# EAGLE design Executive_230V_A (EAGLE 9.5.0)
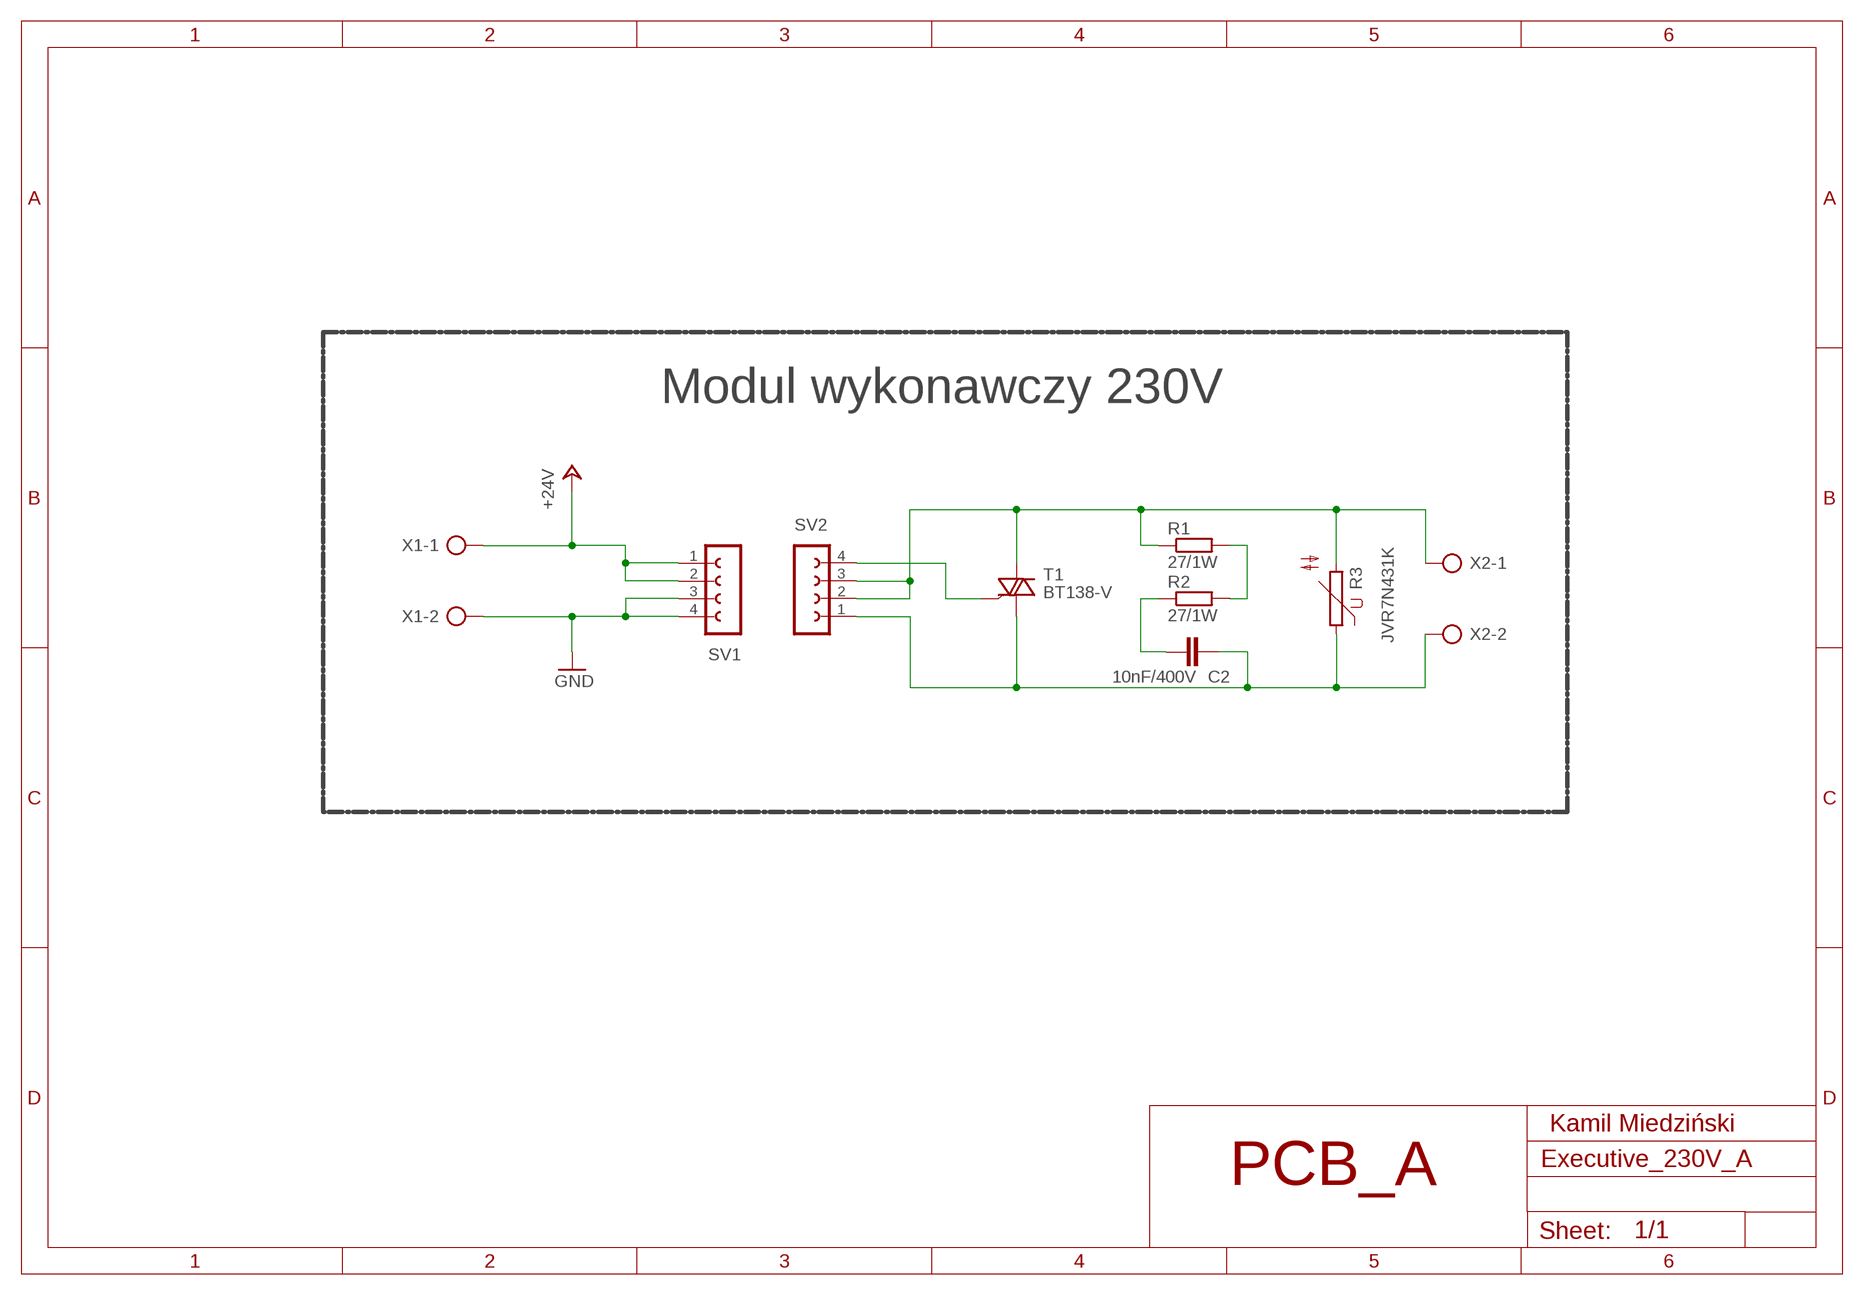
[diagram p0: schematic, sheet 1]

## Parts
C2  10nF/400V  C-EU102-054X133  [C102-054X133]
R1  27/1W  R-EU_0411/15  [0411/15]
R2  27/1W  R-EU_0411/15  [0411/15]
R3  JVR7N431K  S05K11  [S05K11]
SV1  FE04-1  [FE04-1]
SV2  FE04-1  [FE04-1]
T1  BT138-V  [TO220BV]
X1  GMKDSP_3/2  [GMKDSP_3/2]
X2  GMKDSP_3/2  [GMKDSP_3/2]

## Nets
+24V: SV1.1 SV1.2 X1.1
GND: SV1.3 SV1.4 X1.2
N$1: C2.1 R2.1
N$2: R1.2 R2.2
N$3: SV2.4 T1.G
N$4: C2.2 R3.1 SV2.1 T1.T1(A1) X2.2
N$7: R1.1 R3.2 SV2.2 SV2.3 T1.T2(A2) X2.1

## Notes on the sheet
- Modul wykonawczy 230V
- Kamil Miedziński
- PCB_A

## Library data of the parts
C2 = rcl:C-EU: CAPACITOR, European symbol; SPICEPREFIX: C
R1 R2 = rcl:R-EU_: RESISTOR, European symbol; SPICEPREFIX: R
R3 = varistor:S05K11: VARISTOR
SV1 SV2 = con-lsta:FE04-1: FEMALE HEADER; OC_FARNELL: unknown; OC_NEWARK: unknown
T1 = triac:BT138: TRIAC Source: http://www.semiconductors.philips.com BT138_SERIES_2.pdf; OC_FARNELL: unknown
X1 X2 = con-ptr500:GMKDSP_3/2: CONNECTOR; OC_FARNELL: unknown; OC_NEWARK: unknown

## Board
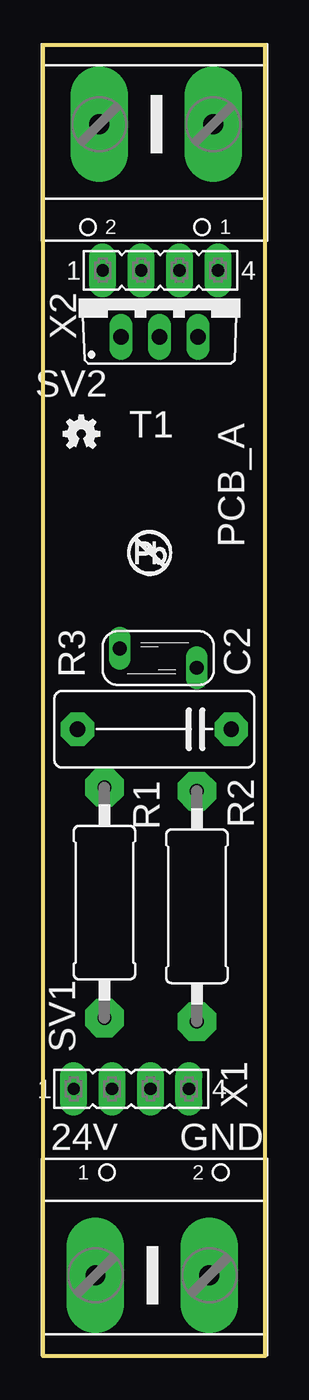
[diagram p1: board, top side]
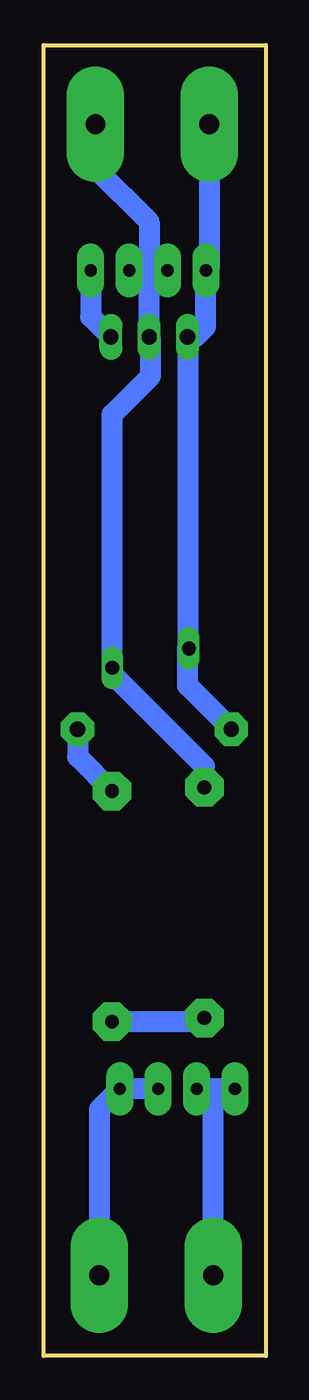
[diagram p2: board, bottom side, seen from below]

Size 14.68 x 86.64 mm. Coordinates in mm from the lower left corner, seen from the top.
Outline: 0,86.64 0,0 14.68,0 14.68,86.64 0,86.64
Copper layers (1*16): Top 0.035mm / dielectric 1.5mm / Bottom 0.035mm
Design rules "default": minimum track width 6mil, minimum drill 0.35mm, track to track 6mil, track to pad 6mil, pad to pad 6mil, via to via 6mil, smd to smd 6mil, copper to edge 40mil, drill to drill 6mil, minimum pad ring 10mil, minimum via ring 8mil, stop-mask expansion 4mil, vias tented up to drill 0mil, thermal gap 10mil

### Footprints (pad centres in the part's own frame; a part is rotated, then mirrored left to right if it is on the bottom)
C102-054X133 = drill 1.016 pad 2.184 octagon: 1 -5.08,0; 2 5.08,0
0411/15 = drill 0.914 pad 2.54 octagon: 1 -7.62,0; 2 7.62,0
S05K11 = drill 0.914 long: 1 -0.635,-2.54; 2 0.635,2.54
FE04-1 = drill 0.813 pad 1.778 long: 1 -3.81,0; 2 -1.27,0; 3 1.27,0; 4 3.81,0
TO220BV = drill 1.016 long: G 2.54,-2.54; T1 -2.54,-2.54; T2 0,-2.54
GMKDSP_3/2 = drill 1.321 pad 3.81 long: 1 -3.765,0; 2 3.765,0

### Placement (x,y rotation side)
C2  7.37,41.42 180 top
R1  4.06,29.96 270 top
R2  10.17,29.72 270 top
R3  7.62,46.12 270 top
SV1  5.84,17.65 0 top
SV2  7.76,71.75 0 top
T1  7.71,69.9 0 top
U$1  [NO_PB_LOGO_0.120]  5.33,51.18 0 top
U$2  [OSHW-LOGO-MINI]  2.54,60.96 0 top
X1  7.24,5.33 0 top
X2  7.49,81.41 180 top

### Tracks (layer width: path | path; a pad name or v marks a point on that pad's centre or on a via)
+24V
  Bottom 1.27: 3.47,17.32 3.81,17.65
  Bottom 1.4: SV1.1 3.81,17.65 SV1.2 | X1.1 3.47,17.32
GND
  Bottom 1.4: SV1.3 SV1.4 11,16.3 X1.2
N$1
  Bottom 1.4: C2.1 12.45,39.61 R2.1
N$2
  Bottom 1.4: R1.2 4.31,22.1 R2.2
N$3
  Bottom 1.4: SV2.4 11.57,68.68 T1.G
N$4
  Bottom 1.27: 5.17,46.85 R3.1 | 3.73,71.98 SV2.1 4,71.71 | 4.64,67.36 T1.T1
  Bottom 1.4: T1.T1 5.17,46.85 5.17,44.3 C2.2 | X2.2 3.73,71.98 | 4,71.71 4,68 4.64,67.36
N$7
  Bottom 1.27: SV2.3 9.16,71.88 | 7.62,67.27 T1.T2 | 10.16,45.09 R3.2 | 7.71,71.55 7.5,71.75
  Bottom 1.4: R3.2 10.16,62.23 7.62,64.77 7.62,67.27 | R1.1 4.06,38.99 10.16,45.09 | SV2.2 7.5,71.75 SV2.3 | T1.T2 7.71,71.55 7.71,74.96 11.26,78.51 X2.1

### Text on the board
tNames: PCB_A | 24V | GND